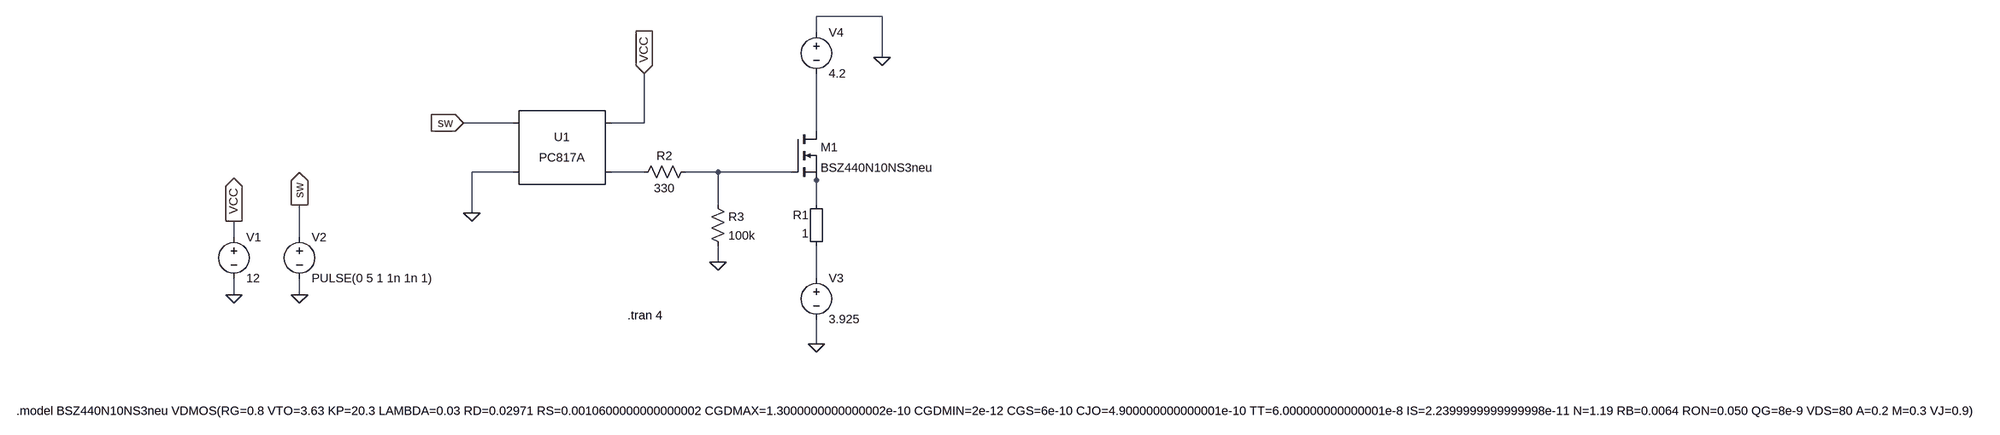
[diagram p0: schematic Pullup Optokoppler real.asc]
Pullup Optokoppler real.asc, the LTspice schematic file:
Version 4.1
SHEET 1 5152 772
WIRE 992 -128 864 -128
WIRE 864 -96 864 -128
WIRE 992 -48 992 -128
WIRE 272 80 176 80
WIRE 528 80 528 -16
WIRE 528 80 464 80
WIRE 864 96 864 -16
WIRE 272 176 192 176
WIRE 528 176 464 176
WIRE 672 176 608 176
WIRE 816 176 672 176
WIRE 864 192 864 176
WIRE 672 240 672 176
WIRE 864 240 864 192
WIRE 192 256 192 176
WIRE -272 304 -272 272
WIRE -144 304 -144 240
WIRE 672 352 672 320
WIRE 864 384 864 320
WIRE -272 416 -272 384
WIRE -144 416 -144 384
WIRE 864 512 864 464
FLAG -272 416 0
FLAG -272 272 VCC
IOPIN -272 272 Out
FLAG -144 416 0
FLAG -144 240 sw
IOPIN -144 240 Out
FLAG 672 352 0
FLAG 864 512 0
FLAG 176 80 sw
IOPIN 176 80 In
FLAG 528 -16 VCC
IOPIN 528 -16 In
FLAG 192 256 0
FLAG 992 -48 0
SYMBOL voltage -272 288 R0
SYMATTR InstName V1
SYMATTR Value 12
SYMBOL voltage -144 288 R0
WINDOW 123 0 0 Left 0
WINDOW 39 0 0 Left 0
SYMATTR InstName V2
SYMATTR Value PULSE(0 5 1 1n 1n 1)
SYMBOL res 512 192 R270
WINDOW 0 32 56 VTop 2
WINDOW 3 0 56 VBottom 2
SYMATTR InstName R2
SYMATTR Value 330
SYMBOL res 656 224 R0
SYMATTR InstName R3
SYMATTR Value 100k
SYMBOL voltage 864 368 R0
SYMATTR InstName V3
SYMATTR Value 3.925
SYMBOL voltage 864 -112 R0
SYMATTR InstName V4
SYMATTR Value 4.2
SYMBOL Misc\\EuropeanResistor 880 336 R180
WINDOW 0 31 76 Left 2
WINDOW 3 31 40 Left 2
SYMATTR InstName R1
SYMATTR Value 1
SYMBOL Optos\\PC817A 368 128 R0
SYMATTR InstName U1
SYMBOL nmos 816 96 R0
SYMATTR InstName M1
SYMATTR Value BSZ440N10NS3neu
TEXT 496 456 Left 2 !.tran 4
TEXT -696 656 Left 2 !.model BSZ440N10NS3neu VDMOS(RG=0.8 VTO=3.63 KP=20.3 LAMBDA=0.03 RD=0.02971 RS=0.0010600000000000002 CGDMAX=1.3000000000000002e-10 CGDMIN=2e-12 CGS=6e-10 CJO=4.900000000000001e-10 TT=6.000000000000001e-8 IS=2.2399999999999998e-11 N=1.19 RB=0.0064 RON=0.050 QG=8e-9 VDS=80 A=0.2 M=0.3 VJ=0.9)

The netlist it stands for:
* Pullup Optokoppler real.asc
V1 VCC 0 12
V2 sw 0 PULSE(0 5 1 1n 1n 1)
R2 N002 N003 330
R3 N003 0 100k
V3 N005 0 3.925
V4 0 N001 4.2
R1 N005 N004 1
X§U1 sw 0 VCC N002 PC817 Igain=1m
M1 N001 N003 N004 N004 BSZ440N10NS3neu
.model NMOS NMOS
.model PMOS PMOS
.lib standard.mos
.tran 4
.model BSZ440N10NS3neu VDMOS(RG=0.8 VTO=3.63 KP=20.3 LAMBDA=0.03 RD=0.02971 RS=0.0010600000000000002 CGDMAX=1.3000000000000002e-10 CGDMIN=2e-12 CGS=6e-10 CJO=4.900000000000001e-10 TT=6.000000000000001e-8 IS=2.2399999999999998e-11 N=1.19 RB=0.0064 RON=0.050 QG=8e-9 VDS=80 A=0.2 M=0.3 VJ=0.9)
.lib PC817.sub
.backanno
.end